# Altium schematic sheet updated_loraxbee_ldo sheet.SchDoc
size A4; SheetNumber: 1; SheetTotal: 2
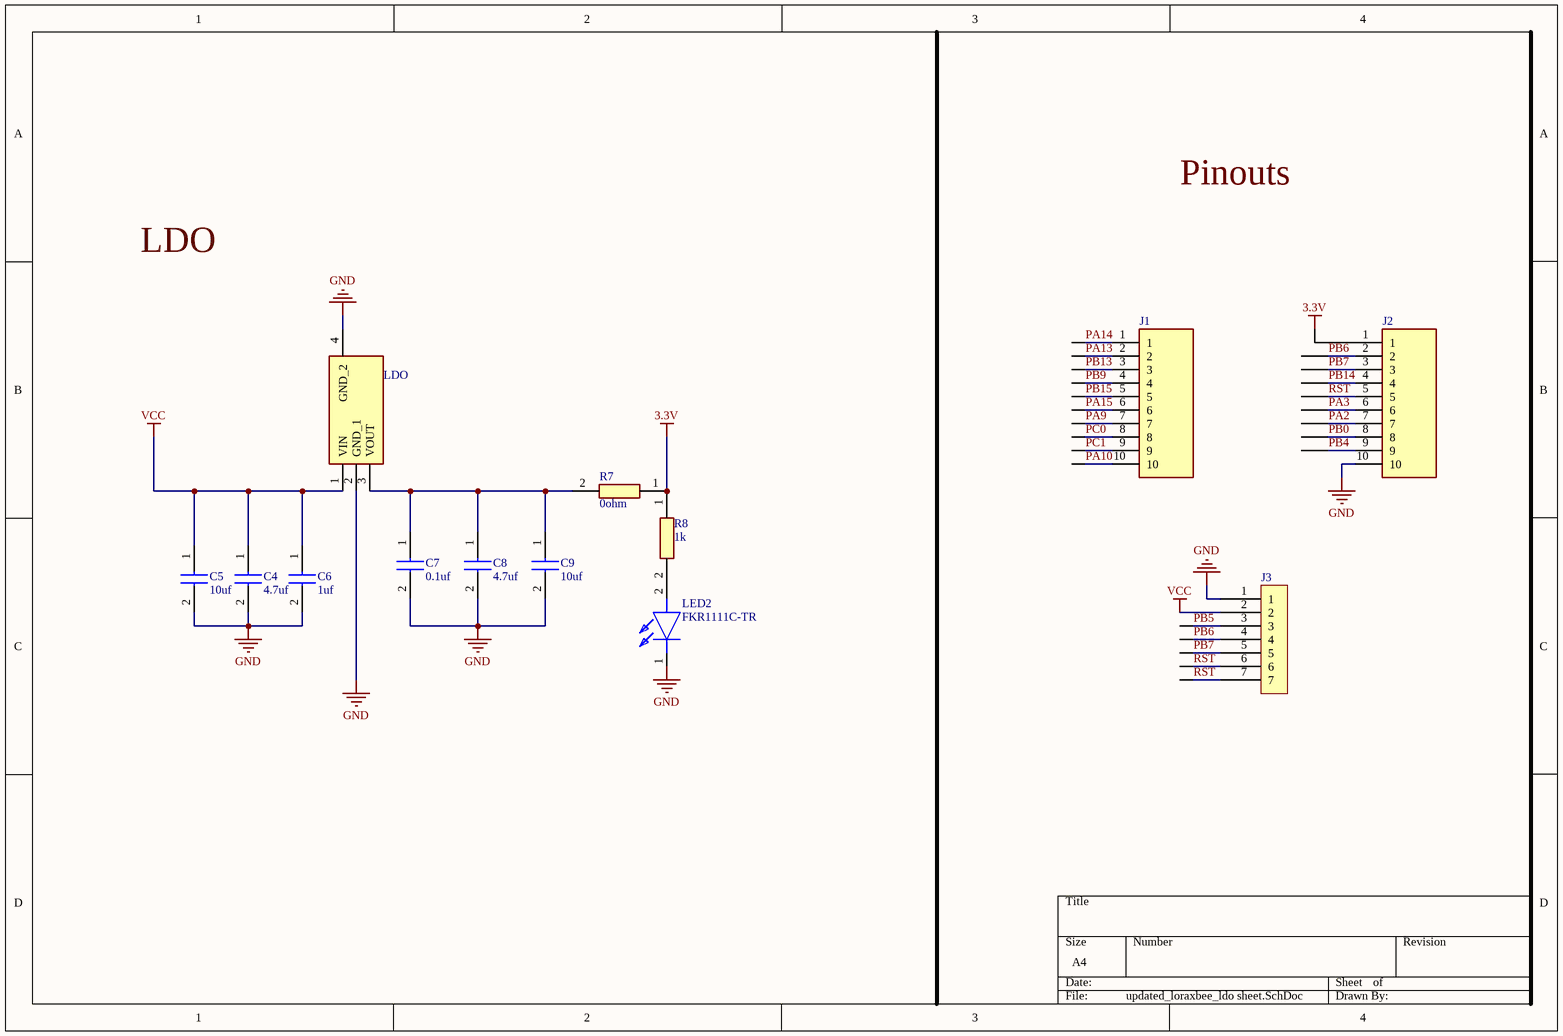
[diagram p0: updated_loraxbee_ldo sheet.SchDoc]

## Parts
C4  4.7uf  [CAPC1608X100N]
C5  10uf  [CAPC1608X100N]
C6  1uf  [CAPC1608X100N]
C7  0.1uf  [CAPC1608X100N]
C8  4.7uf  [CAPC1608X100N]
C9  10uf  [CAPC1608X100N]
J1  2MM-HB-S10-VT-02-H-TB  [HDRV10W53P0X200_1X10_1980X200X555P]  (value not drawn)
J2  2MM-HB-S10-VT-02-H-TB  [HDRV10W53P0X200_1X10_1980X200X555P]  (value not drawn)
J3  7 pin 2.54mm pitch header  [2.5mm 7 pin header]  (value not drawn)
LDO  TC1264-3.3VDB  [SOT230P700X180-4N]  (value not drawn)
LED2  FKR1111C-TR  [LED-0603-BLUE]
R7  0ohm  [RESC1608X55N]
R8  1k  [RESC1608X55N]

## Nets
3.3V: J2.1 R7.1 R8.1
GND: C4.2 C5.2 C6.2 C7.2 C8.2 C9.2 J2.10 J3.1 LDO.2(GND_1) LDO.4(GND_2) LED2.1(K)
VCC: C4.1 C5.1 C6.1 J3.2 LDO.1(VIN)
PA2: J2.7
PA3: J2.6
PA9: J1.7
PA10: J1.10
PA13: J1.2
PA14: J1.1
PA15: J1.6
PB0: J2.8
PB4: J2.9
PB5: J3.3
PB6: J2.2 J3.4
PB7: J2.3 J3.5
PB9: J1.4
PB13: J1.3
PB14: J2.4
PB15: J1.5
PC0: J1.8
PC1: J1.9
RST: J2.5 J3.6 J3.7
NetC7_1: C7.1 C8.1 C9.1 LDO.3(VOUT) R7.2
NetLED2_2: LED2.2(A) R8.2

## Notes on the sheet
- Pinouts
- LDO

## Library data of the parts
C4-C9 = GCJ188C70J475KE02D: Capacitor; Manufacturer_Name: Murata Electronics; Datasheet Link: https://psearch.en.murata.com/capacitor/product/GCJ188C70J475KE02%23.html; Height: 1mm; Manufacturer_Part_Number: GCJ188C70J475KE02D; Mouser Part Number: 81-GCJ188C70J475KE2D; Mouser Price/Stock: https://www.mouser.co.uk/ProductDetail/Murata-Electronics/GCJ188C70J475KE02D?qs=QzBtWTOodeVfJR8CElrI4A%3D%3D; Arrow Part Number: GCJ188C70J475KE02D; Arrow Price/Stock: https://www.arrow.com/en/products/gcj188c70j475ke02d/murata-manufacturing?region=nac
J1 J2 = 2MM-HB-S10-VT-02-H-TB: Connector; Manufacturer_Name: TE Connectivity; Datasheet Link: https://www.mouser.com/datasheet/2/418/9/ENG_DS_1_1773952_5_1915-3118174.pdf; Height: 5.55mm; Manufacturer_Part_Number: 2MM-HB-S10-VT-02-H-TB; Mouser Part Number: 571-2MM-HBS10VT02HTB; Mouser Price/Stock: https://www.mouser.co.uk/ProductDetail/TE-Connectivity/2MM-HB-S10-VT-02-H-TB?qs=9vOqFld9vZW8PvcL2%252Bd%2FMA%3D%3D
LDO = TC1264-3.3VDB: Integrated Circuit; Manufacturer_Name: Microchip; Datasheet Link: http://ww1.microchip.com/downloads/en/devicedoc/21375d.pdf; Height: 1.8mm; Manufacturer_Part_Number: TC1264-3.3VDB; Mouser Part Number: 579-TC1264-3.3VDB; Mouser Price/Stock: https://www.mouser.co.uk/ProductDetail/Microchip-Technology/TC1264-3.3VDB?qs=AkCjCAp%252BzjQSxS5e2ugTcA%3D%3D; Arrow Part Number: TC1264-3.3VDB; Arrow Price/Stock: https://www.arrow.com/en/products/tc1264-3.3vdb/microchip-technology?region=nac
LED2 = FKR1111C-TR: LED; Manufacturer_Name: Stanley Electric; Datasheet Link: http://www.stanley-components.com/php/downloaddatafile.php?rp=0,FKR1111C-TR_e.pdf; Height: 0.8mm; Manufacturer_Part_Number: FKR1111C-TR; Mouser Part Number: 327-FKR1111CTR; Mouser Price/Stock: https://www.mouser.co.uk/ProductDetail/Stanley-Electric/FKR1111C-TR?qs=byeeYqUIh0N4LNttpqKOoA%3D%3D; Arrow Part Number: FKR1111C-TR; Arrow Price/Stock: https://www.arrow.com/en/products/fkr1111c-tr/stanley-electric?region=nac
R7 R8 = MCT0603HZ0000ZP500: Resistor; Manufacturer_Name: Vishay; Datasheet Link: http://www.vishay.com/docs/28705/mcx0x0xpro.pdf; Height: 0.55mm; Manufacturer_Part_Number: MCT0603HZ0000ZP500; Mouser Part Number: 594-MCT0603HZ0000ZP5; Mouser Price/Stock: https://www.mouser.co.uk/ProductDetail/Vishay-Beyschlag/MCT0603HZ0000ZP500?qs=xy8ZAJ6gwchPwuxyJv%252BYaw%3D%3D; Arrow Part Number: MCT0603HZ0000ZP500; Arrow Price/Stock: https://www.arrow.com/en/products/mct0603hz0000zp500/vishay?region=nac